# EAGLE schematic GPS (EAGLE 9.6.2)
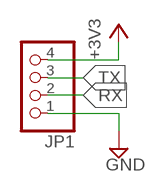
[diagram p0: schematic, sheet 1]

## Parts
JP1  PINHD-1X4  [1X04]

## Nets
+3V3: JP1.4
GND: JP1.1
RX: JP1.2
TX: JP1.3

## Library data of the parts
JP1 = GTOR - Connectors:PINHD-1X4: PIN HEADER